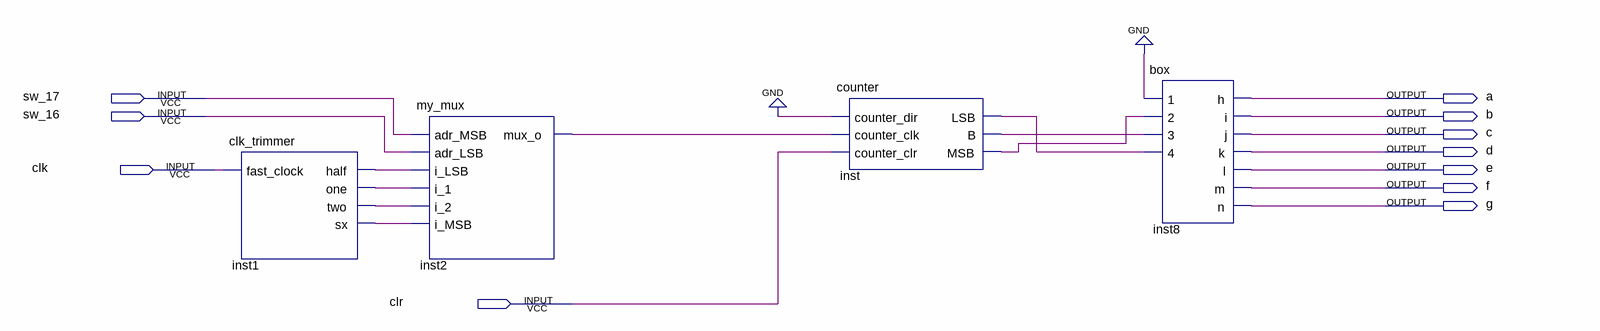
[diagram p0: schematic sheet]
// Quartus schematic bcd.bdf as structural Verilog: 4 symbols, 11 pins
module bcd (
  input  sw_17,
  input  sw_16,
  input  clk,
  input  clr,
  output a,
  output b,
  output c,
  output d,
  output e,
  output f,
  output g
);

  wire inst1_half, inst1_one, inst1_sx, inst1_two, inst2_mux_o, inst_b, inst_lsb, inst_msb;

  clk_trimmer inst1 (.fast_clock(clk), .half(inst1_half), .one(inst1_one), .two(inst1_two), .sx(inst1_sx));
  my_mux inst2 (
    .adr_MSB(sw_17), .adr_LSB(sw_16), .i_LSB(inst1_half), .i_1(inst1_one), .i_2(inst1_two), .i_MSB(inst1_sx),
    .mux_o(inst2_mux_o));
  counter inst (
    .counter_dir(1'b0), .counter_clk(inst2_mux_o), .counter_clr(clr), .LSB(inst_lsb), .B(inst_b),
    .MSB(inst_msb));
  box inst8 (.\1 (1'b0), .\2 (inst_msb), .\3 (inst_b), .\4 (inst_lsb), .h(a), .i(b), .j(c), .k(d), .l(e), .m(f), .n(g));
endmodule
